# Altium schematic sheet LiPo_Charger.SchDoc
size A
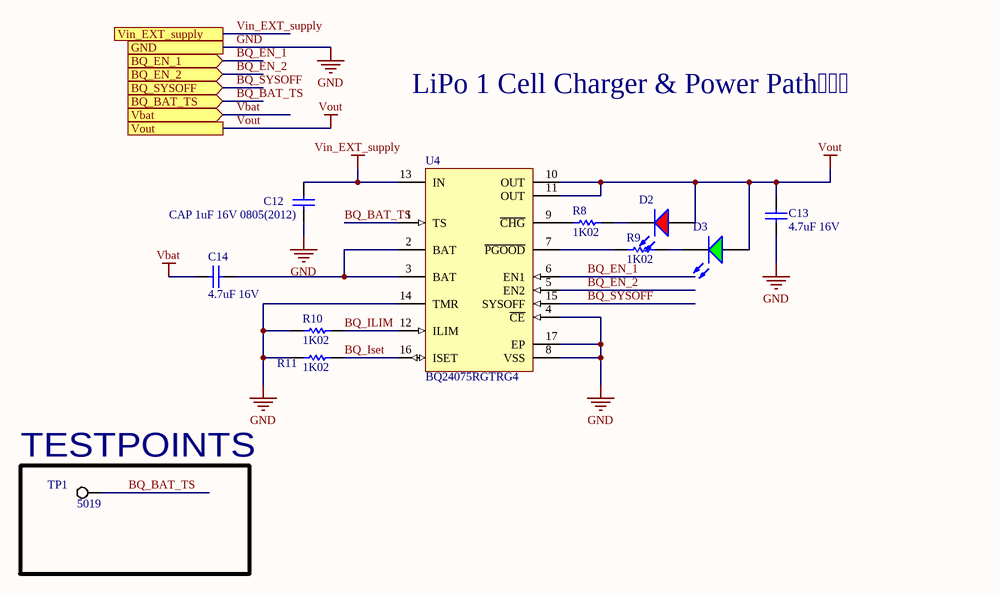
[diagram p0: LiPo_Charger.SchDoc]

## Parts
C12  CAP 1uF 16V 0805(2012)  [CAPC0805(2012)100_L]
C13  4.7uF 16V  [CAPC0805(2012)145_N]
C14  4.7uF 16V  [CAPC0805(2012)145_N]
D2  (no value)  [LTST-C170CKT_V]
D3  (no value)  [LTST-C170GKT_V]
R8  1K02  [RESC0603(1608)_N]
R9  1K02  [RESC0603(1608)_N]
R10  1K02  [RESC0603(1608)_N]
R11  1K02  [RESC0603(1608)_N]
TP1  5019  [KSTN-5019_V]
U4  BQ24075RGTRG4  [RGT16-1700X1700TP]

## Blocks framed on the sheet
TESTPOINTS: TP1

## Ports
BQ_BAT_TS (in), BQ_EN_1 (in), BQ_EN_2 (in), BQ_SYSOFF (in), GND, Vbat (in), Vin_EXT_supply, Vout

## Nets
GND: C12.1 C13.1 R10.1 R11.1 U4.4(~{CE}) U4.8(VSS) U4.14(TMR) U4.17(EP) ; port GND
Vbat: C14.2 ; port Vbat
Vin_EXT_supply: C12.2 U4.13(IN) ; port Vin_EXT_supply
Vout: C13.2 D2.A D3.1(A) U4.10(OUT) U4.11(OUT) ; port Vout
BQ_BAT_TS: TP1.1 U4.1(TS) ; port BQ_BAT_TS
BQ_EN_1: U4.6(EN1) ; port BQ_EN_1
BQ_EN_2: U4.5(EN2) ; port BQ_EN_2
BQ_ILIM: R10.2 U4.12(ILIM)
BQ_Iset: R11.2 U4.16(ISET)
BQ_SYSOFF: U4.15(SYSOFF) ; port BQ_SYSOFF
NetC14_1: C14.1 U4.2(BAT) U4.3(BAT)
NetD2_C: D2.C R8.2
NetD3_2: D3.2(K) R9.2
NetR8_1: R8.1 U4.9(~{CHG})
NetR9_1: R9.1 U4.7(~{PGOOD})

## Notes on the sheet
- LiPo 1 Cell Charger & Power Path

## Library data of the parts
C12 = CMP-1036-04749-1: CAP 1uF 16V ±20% 0805 (2012 Metric) Thickness 1mm SMD; Case-EIA: 0805; Case-Metric: 2012; Tolerance: Â±20%; Value: 1uF; Rated Voltage: 16 V; Max Thickness: 1 mm; Technology: SMT
C13 C14 = CMP-1036-04889-1: CAP 4.7uF 16V ±10% 0805 (2012 Metric) Thickness 1.45mm SMD; Case-EIA: 0805; Case-Metric: 2012; Tolerance: Â±10%; Technology: SMT; Value: 4.7uF; Rated Voltage: 16 V; Max Thickness: 1.45 mm
D2 = CMP-1674-00001-3: LED RED CLEAR 0805 SMD; Manufacturer: Lite-On; PartNumber: LTST-C170CKT; PackageReference: C170CKT; ComponentLink1Description: Datasheet; ComponentLink1URL: http://media.digikey.com/pdf/Data%20Sheets/Lite-On%20PDFs/LTST-C170CKT.pdf
D3 = CMP-1674-00002-4: LED Uni-Color Green, 100 mW, 120 mA, -55 to 85 degC, 2-Pin SMD, RoHS, Tape and Reel; DatasheetVersion: 03/2003; Package Quantity: 1; Pins: 2; Mounting Technology: Surface Mount; Mount: Surface Mount; PackageReference: C170GKT; PackageDescription: 2-Pin Surface Mount Device, Body 2 x 1.25 mm; Colour: Green; Packaging: Tape and Reel; Height: 1.1 mm; Max Operating Temperature: 85 degC; Length: 2 mm; RoHSCompliant: true; Min Operating Temperature: -55 degC
R8-R11 = CMP-1012-00511-1: 1K02 0.1W 1% 0603 (1608 Metric)  SMD; Value: 1020.00 Ohm; Case-EIA: 0603; Case-Metric: 1608; Technology: SMT; Power: 0.1 W; Tolerance: 1 %
TP1 = CMP-1672-00008-1: Test Point, 1 Position SMD, RoHS, Tape and Reel; ComponentLink1Description: Manufacturer URL; Package Quantity: 1000; DatasheetVersion: 03/2014; Packaging: Tape and Reel; ComponentLink2URL: http://www.keyelco.com/product-pdf.cfm?p=1357; ComponentLink1URL: http://www.keyelco.com/; Mount: Surface Mount; Contact Plating: Silver; PackageDescription: 1-Pin Surface Mount Device, Body 3.81 x 2.03 mm; Pins: 1; RoHSCompliant: True; Mounting Technology: Surface Mount; ComponentLink2Description: Datasheet; PackageReference: 5019
U4 = CMP-0321-00237-1: USB-Friendly Li-Ion Battery Charger and Power-Path Management IC, Vout 5.5 V, 4.3 V, -40 to 85 degC, 16-pin QFN (RGT), Green (RoHS & no Sb/Br); Manufacturer: Texas Instruments; Li-Ion: N; SubFamily: Battery Charge Management; Vin(Min)(V): 4.3; ComponentLink1URL: http://www.ti.com/general/docs/lit/getliterature.tsp?genericPartNumber=BQ24075&fileType=pdf; Over Voltage Protection: N; PackageDescription: 16-Pin Plastic Quad Flat No-Lead, 3 x 3 mm Body, 0.5 mm Pitch, 1.7 x 1.7 mm Exposed Pad; NiMH: N; Li-Polymer: N; Eco-Plan: Green (RoHS & no Sb/Br); Code_JEDEC: MO-220; Lead Acid: N; PartNumber: BQ24075RGTRG4; ComponentLink1Description: Datasheet; Mounting Technology: Surface Mount; PackageVersion: revH, Oct-2011; PackageReference: RGT16-1700X1700TP; NiCd: N; DatasheetVersion: SLUS810G